# Altium schematic sheet ArduinoISP.SchDoc
size A
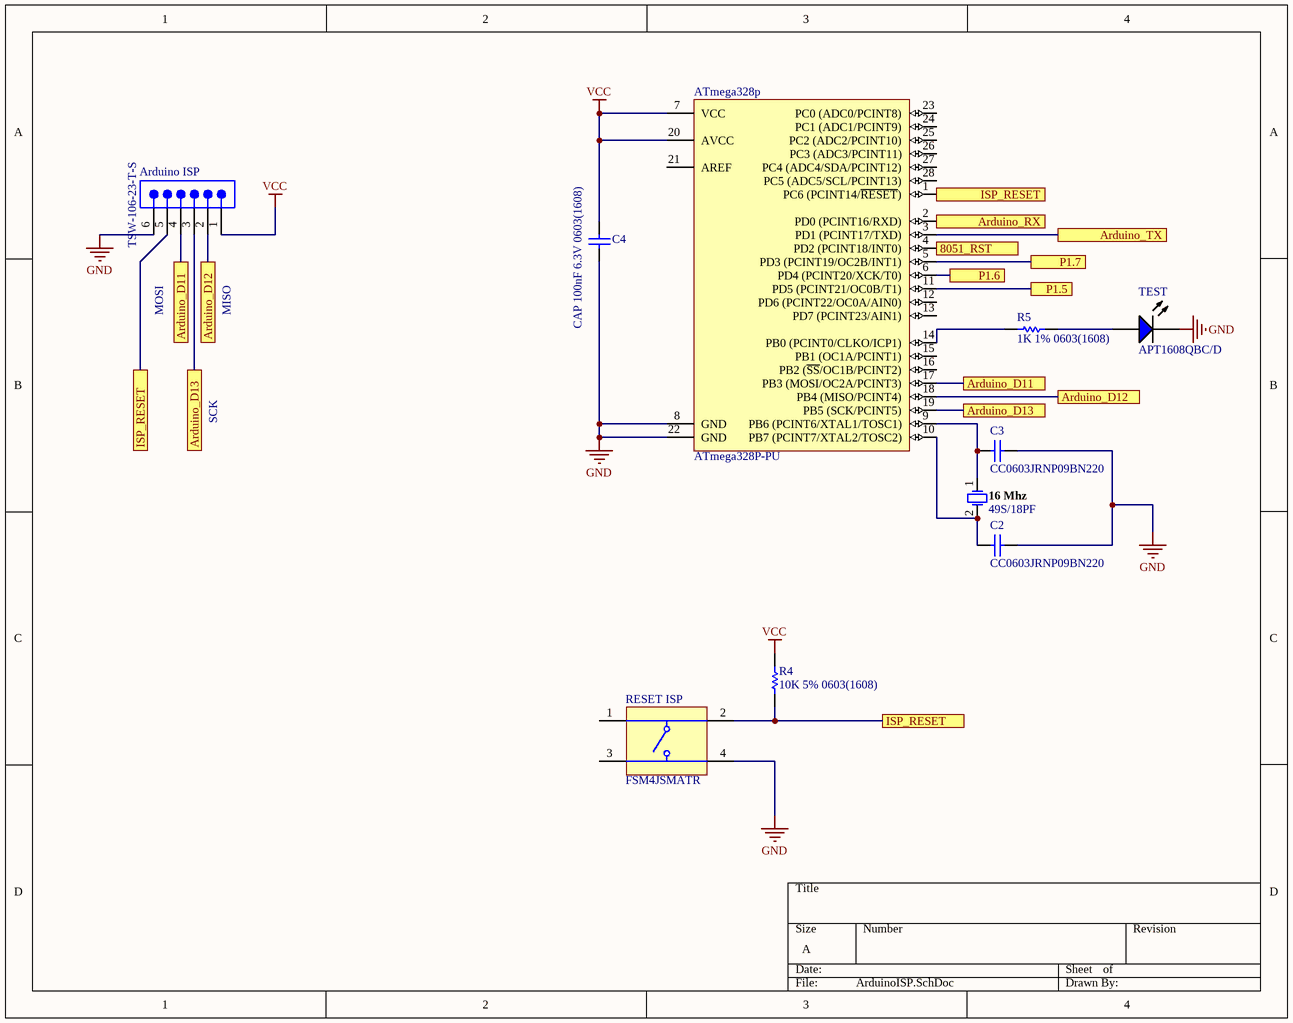
[diagram p0: ArduinoISP.SchDoc]

## Parts
16_Mhz  49S/18PF  [JPY-49S-18PF]
Arduino_ISP  TSW-106-23-T-S  [SMTC-TSW-106-23-X-S]
ATmega328p  ATmega328P-PU  [28P3]
C2  CC0603JRNP09BN220  [CAPC1608X90X40ML10T20]
C3  CC0603JRNP09BN220  [CAPC1608X90X40ML10T20]
C4  CAP 100nF 6.3V 0603(1608)  [CAPC0603(1608)100_L]
R4  10K 5% 0603(1608)  [RESC0603(1608)_N]
R5  1K 1% 0603(1608)  [RESC0603(1608)_M]
RESET_ISP  FSM4JSMATR  [TECO-FSM4JSMATR_V]
TEST  APT1608QBC/D  [KING-APT1608QBCD_V]

## Ports
8051_RST, Arduino_D11, Arduino_D12, Arduino_D13, Arduino_RX, Arduino_TX, ISP_RESET, P1.5, P1.6, P1.7

## Nets
GND: Arduino_ISP.6 ATmega328p.8(GND) ATmega328p.22(GND) C2.2 C3.2 C4.1 RESET_ISP.4 TEST.2(K)
VCC: Arduino_ISP.1 ATmega328p.7(VCC) ATmega328p.20(AVCC) C4.2 R4.1
8051_RST: ATmega328p.4(PD2_(PCINT18/INT0)) ; port 8051_RST
Arduino_D11: Arduino_ISP.4 ATmega328p.17(PB3_(MOSI/OC2A/PCINT3)) ; port Arduino_D11
Arduino_D12: Arduino_ISP.2 ATmega328p.18(PB4_(MISO/PCINT4)) ; port Arduino_D12
Arduino_D13: Arduino_ISP.3 ATmega328p.19(PB5_(SCK/PCINT5)) ; port Arduino_D13
Arduino_RX: ATmega328p.2(PD0_(PCINT16/RXD)) ; port Arduino_RX
Arduino_TX: ATmega328p.3(PD1_(PCINT17/TXD)) ; port Arduino_TX
ISP_RESET: Arduino_ISP.5 ATmega328p.1(PC6_(PCINT14/~{RESET})) R4.2 RESET_ISP.2 ; port ISP_RESET
P1.5: ATmega328p.11(PD5_(PCINT21/OC0B/T1)) ; port P1.5
P1.6: ATmega328p.6(PD4_(PCINT20/XCK/T0)) ; port P1.6
P1.7: ATmega328p.5(PD3_(PCINT19/OC2B/INT1)) ; port P1.7
Net16_Mhz_1: 16_Mhz.1 ATmega328p.9(PB6_(PCINT6/XTAL1/TOSC1)) C3.1
Net16_Mhz_2: 16_Mhz.2 ATmega328p.10(PB7_(PCINT7/XTAL2/TOSC2)) C2.1
NetATmega328p_14: ATmega328p.14(PB0_(PCINT0/CLKO/ICP1)) R5.1
NetR5_2: R5.2 TEST.1(A)

Not connected (* = marked no-connect by the designer): ATmega328p 12(PD6_(PCINT22/OC0A/AIN0)) 13(PD7_(PCINT23/AIN1)) 15(PB1_(OC1A/PCINT1)) 16(PB2_(~{SS}/OC1B/PCINT2)) 21(AREF) 23(PC0_(ADC0/PCINT8)) 24(PC1_(ADC1/PCINT9)) 25(PC2_(ADC2/PCINT10)) 26(PC3_(ADC3/PCINT11)) 27(PC4_(ADC4/SDA/PCINT12)) 28(PC5_(ADC5/SCL/PCINT13)); RESET_ISP 1 3

## Notes on the sheet
- MOSI
- MISO
- SCK

## Library data of the parts
16_Mhz = CMP-2100-03581-1: Crystal, 16 MHz, 18 pF, -20 to 70 degC, 2-Pin THD; Manufacturer: Shenzhen Jingpengyuan; Package Description: 2-Pin Through Hole Device, Body 11.05 x 4.65 mm, Pitch 4.88 mm; Package Reference: 49S-18PF; Datasheet Version: 41852.0; Datasheet URL: http://datasheet.octopart.com/49S-18PF-Xinhunjing-datasheet-30677139.pdf; Manufacturer URL: http://www.chjiahui.com/
Arduino_ISP = CMP-1024-00395-1: Manufacturer: Samtec; Pitch: 2.54 mm; PackageReference: TSW-106-23-X-S; ComponentLink1URL: http://www.samtec.com; ComponentLink1Description: Manufacturer URL; PackageVersion: DM, 8/1988; ComponentLink2Description: Datasheet; Mounting Technology: Through-hole; Orientation: Vertical; ComponentLink2URL: http://www.samtec.com/documents/webfiles/pdf/TSW_TH.PDF; PackageDescription: .025[0.64] SQ. Post Terminal Strip Assembly; ComponentLink3Description: Package Specification; RoHS: True; DatasheetVersion: F-214; Temperature Range: -55 to 105 degC; PartNumber: TSW-106-23-T-S; ComponentLink3URL: http://www.samtec.com/documents/webfiles/cpdf/TSW-XXX-XX-XXX-X-XX-XXX-MKT.pdf
ATmega328p = CMP-0095-00013-2: 8-bit AVR Microcontroller, 32KB Flash, 1KB EEPROM, 2KB SRAM, 28-pin PDIP, Industrial Grade (-40°C to 85°C); RevisionNote: DatasheetVersion updated. URLs added.; PackageVersion: revB, Sep-2001; DatasheetVersion: revD, May-2011; ComponentLink1Description: Manufacturer URL; ComponentLink1URL: http://www.atmel.com/; PackageReference: 28P3; ComponentLink2Description: ATmega48A/48PA/88A/88PA/168A/168PA/328/328P Datasheet; ComponentLink3URL: http://www.atmel.com/dyn/resources/prod_documents/8271S.pdf; ComponentLink2URL: http://www.atmel.com/dyn/resources/prod_documents/8271.pdf; ComponentLink3Description: ATmega48A/48PA/88A/88PA/168A/168PA/328/328P Summary; PackageDescription: 28-lead (0.300"/7.62mm Wide) Plastic Dual Inline Package (PDIP)
C2 C3 = CMP-1659-00006-3: Chip Capacitor, 22 pF, +/- 5%, 50 V, -55 to 125 degC, 0603 (1608 Metric), RoHS, Tape and Reel; Mount: Surface Mount; PackageReference: 0603; DatasheetVersion: Rev. 13, 05/2016; RoHSCompliant: true; PackageDescription: 2-Pin Surface Mount Device, Body 1.6 x 0.8 mm; Min Operating Temperature: -55 degC; Length: 1.6 mm; Mounting Technology: Surface Mount; Max Operating Temperature: 125 degC
C4 = CMP-1035-02577-1: CAP 100nF 6.3V ±20% 0603 (1608 Metric) Thickness 1mm SMD; Case-EIA: 0603; Case-Metric: 1608; Tolerance: Â±20%; Technology: SMT; Rated Voltage: 6.3 V; Value: 100nF; Max Thickness: 1 mm
R4 = CMP-1012-00098-1: 10K 0.1W 5% 0603 (1608 Metric)  SMD; Case-EIA: 0603; Value: 10000.00 Ohm; Case-Metric: 1608; Technology: SMT; Tolerance: 5 %; Power: 0.1 W
R5 = CMP-1012-00510-1: 1K 0.1W 1% 0603 (1608 Metric)  SMD; Case-Metric: 1608; Case-EIA: 0603; Value: 1000.00 Ohm; Technology: SMT; Tolerance: 1 %; Power: 0.1 W
RESET_ISP = CMP-2000-07486-1: Micro Miniature Push Button Switch FSM JSM, 50 mA, -35 to 85 degC, 4-Pin SMD, RoHS, Tape and Reel; Manufacturer: TE Connectivity; Mechanical Life: 100000Cycles; Current Rating: 50mA; Actuator Material: Polyamide; Max Voltage Rating (DC): 12V; Capacitance: 0f; Illumination Type: Illuminated; Voltage Rating (DC): 24V; Case\/Package: SMD/SMT; Operating Force: 160gf; Contact Resistance: 100mOhm; Actuator Length: 0.055inch; Switch Travel: 0.25mm; Throw Configuration: SPST; Termination: GullWing; Contact Plating: Silver; Orientation: Straight; Mounting Technology: SurfaceMount; REACH SVHC: Unknown; Electrical Life: 100000Cycles; Package Reference: FSM4JSMATR; Max Operating Temperature: 85degC; Manufacturer URL: http://www.te.com/; Package Description: 4-Pin Surface Mount Device, Body 6 x 6 mm, Pitch 4.5 mm; Datasheet Version: Rev. V, 02/2015; Packaging: TapeandReel; Min Operating Temperature: -35degC; Mount: SurfaceMount; Contact Current Rating: 50mA; Contact Material: CopperAlloy; Package Quantity: 1200; Datasheet URL: http://www.te.com/commerce/DocumentDelivery/DDEController?Action=showdoc&DocId=Customer+Drawing%7F2-1437565-7%7FV%7Fpdf%7FEnglish%7FENG_CD_2-1437565-7_V.pdf%7F4-1437565-2; RoHSCompliant: true
TEST = CMP-2000-05788-1: Chip LED Lamp, Blue, 5 V, 30 mA, -40 to 85 degC, 2-Pin SMD, RoHS, Tape and Reel; Manufacturer: Kingbright; Voltage - Forward (Vf) (Typ): 3.3V; Lens Color: Colorless; Lens Style/Size: RectanglewithFlatTop,1.20mmx0.80mm; Millicandela Rating: 100mcd; Current - Test: 20mA; Wavelength - Dominant: 465nm; Lens Transparency: Clear; Wavelength - Peak: 460nm; Viewing Angle: 120°; Datasheet URL: http://www.kingbrightusa.com/images/catalog/spec/APT1608QBC-D.pdf; Package / Case: 0603(1608Metric); Package Reference: APT1608QBCD; Mounting Type: SurfaceMount; Datasheet Version: Rev. 13B, 04/2015; Features: -; Series: HELI2; Size / Dimension: 1.60mmLx0.80mmW; Height (Max): 0.75mm; Packaging: Digi-Reel®; Manufacturer URL: http://www.kingbright.com/; Mounting Technology: SurfaceMount; Category: Optoelectronics; Family: LEDIndication-Discrete; Package Description: 2-Pin Surface Mount Device, Body 1.6 x 0.8 mm; Supplier Device Package: ChipLED; Color: Blue